# EasyEDA schematic schematics.json
TITLE: Axon - MIDI to CV; REV: 1.2; Date: 2024-01-22; Sheet: 1/1; Drawn By: Arthur LAURENT; Company: Mental Noise
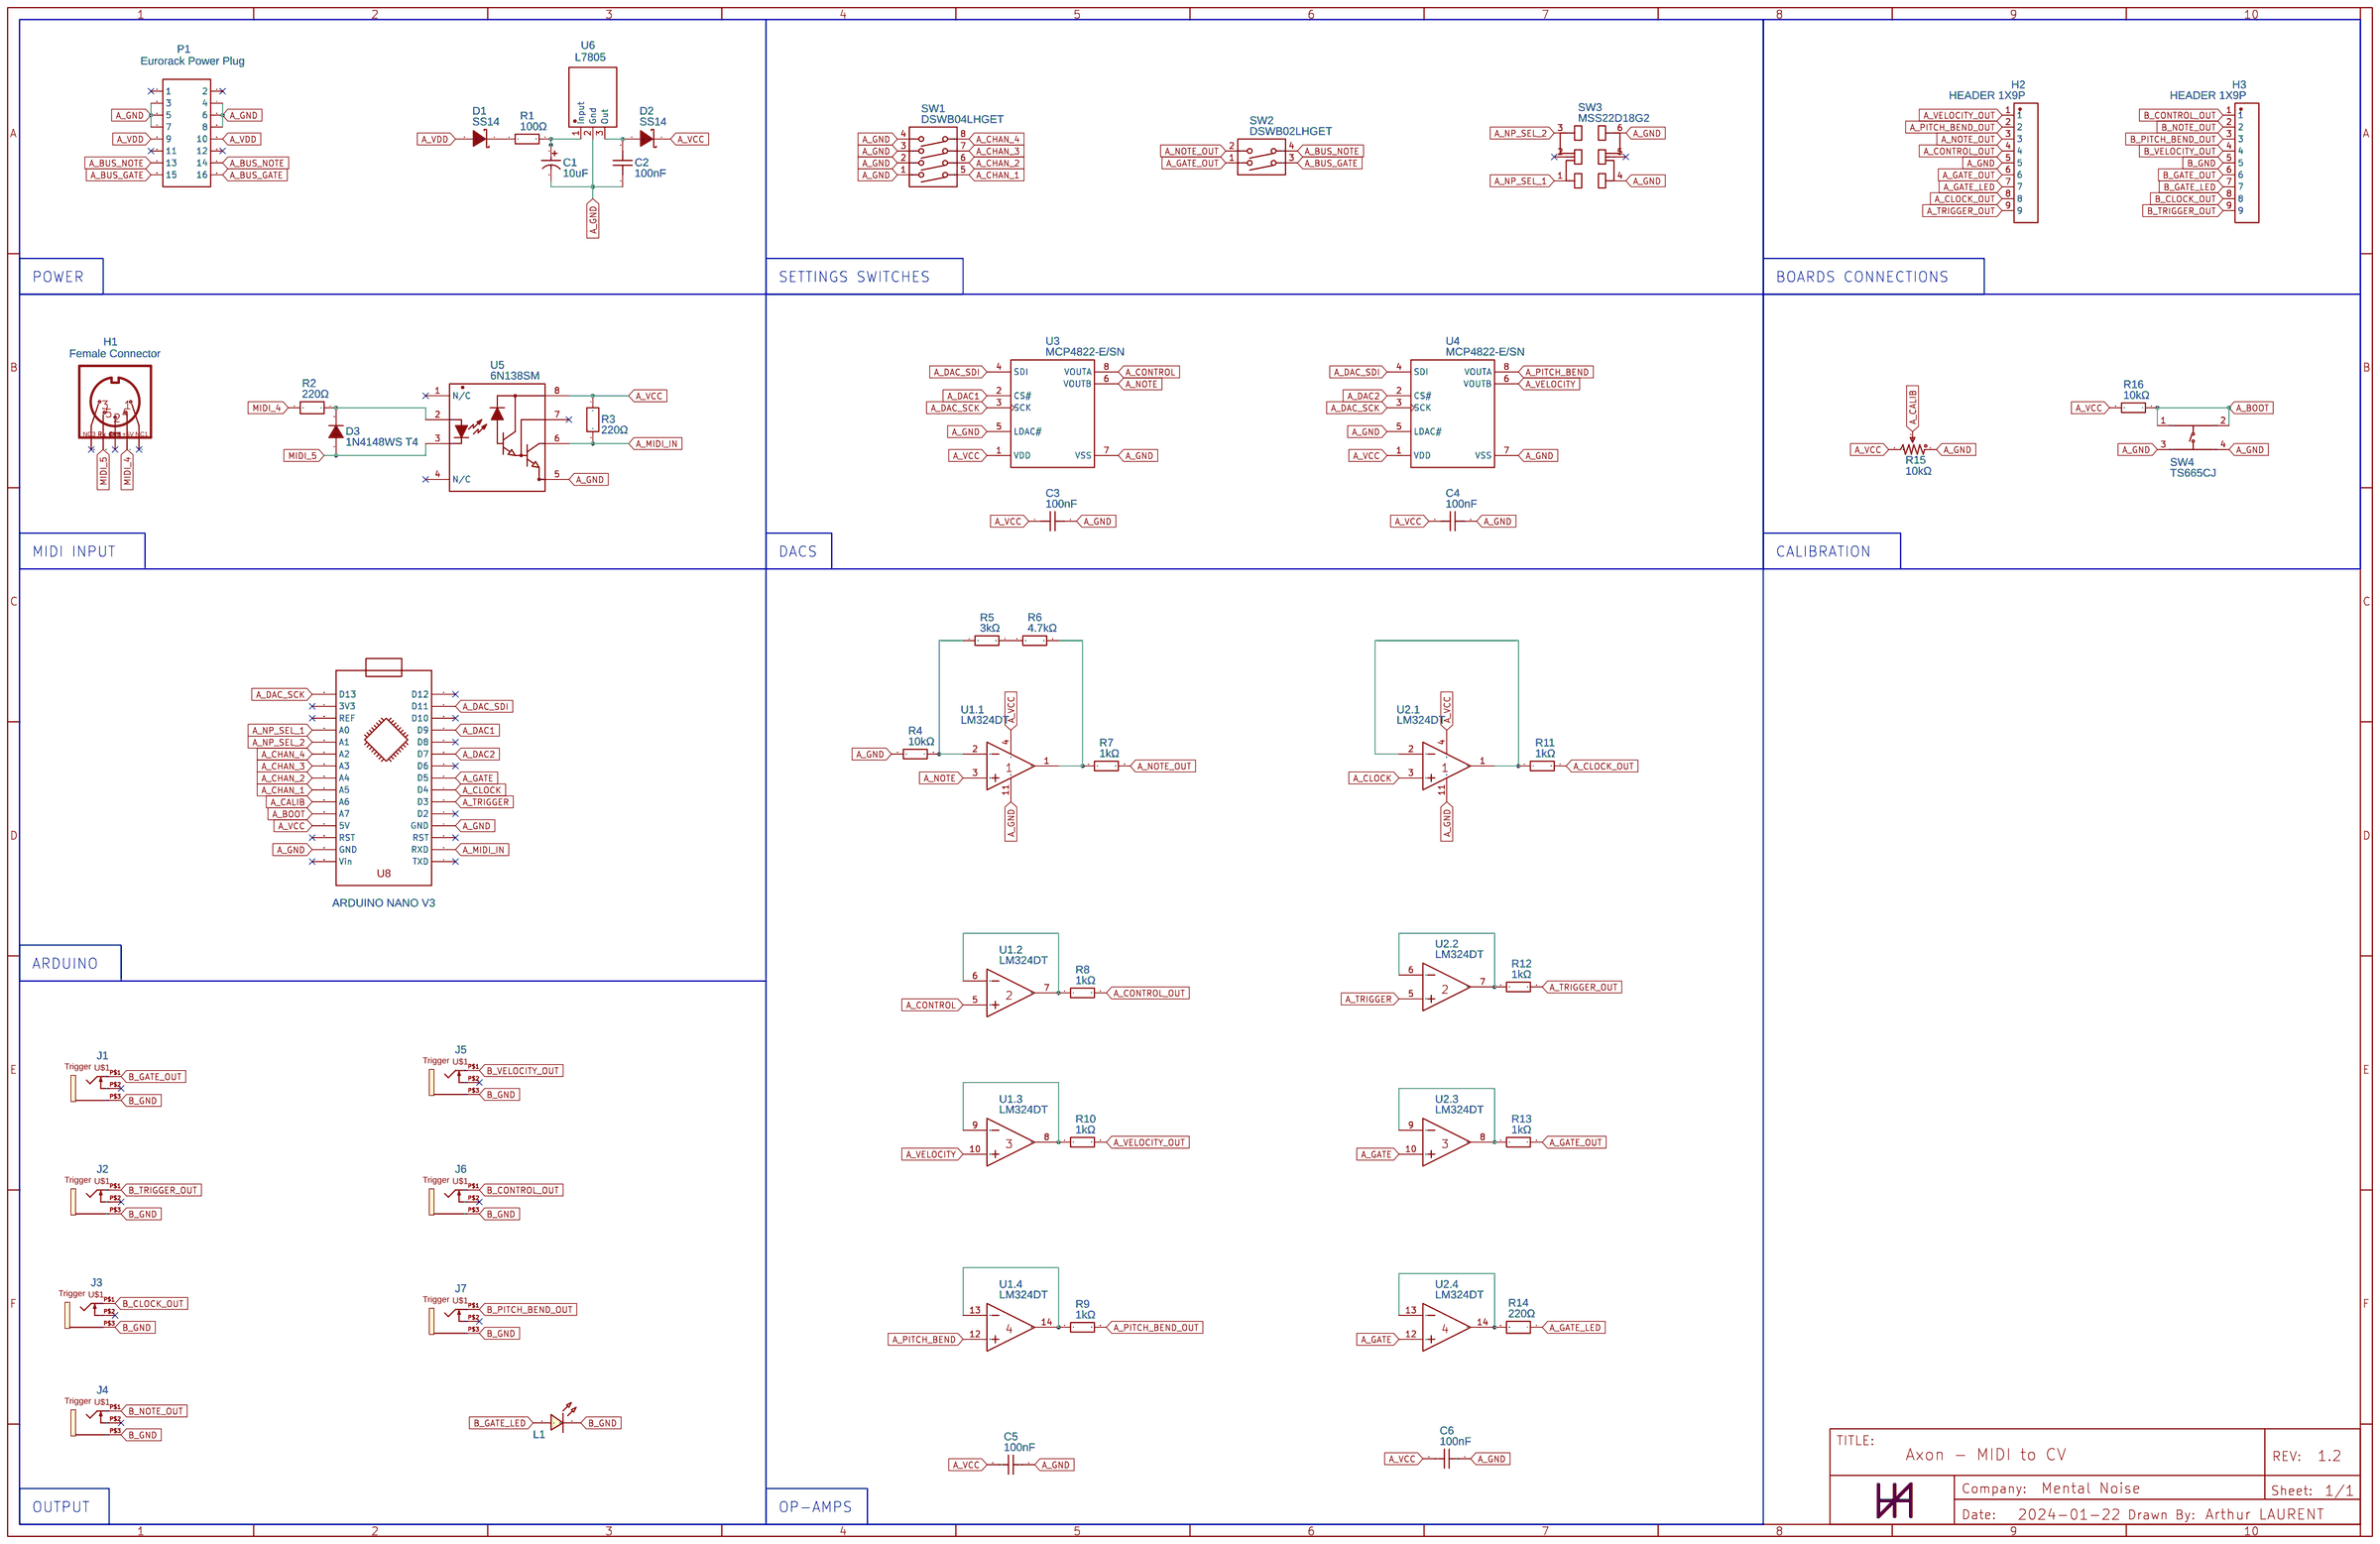
[diagram p0: schematic sheet]

## Parts
C1  10uF  [CAP-TH_BD5.0-P2.00-D0.8-FD]
C2  100nF  [C0603]
C3  100nF  [C0603]
C4  100nF  [C0603]
C5  100nF  [C0603]
C6  100nF  [C0603]
D1  SS14  [SMA_L4.2-W2.6-LS5.3-RD]
D2  SS14  [SMA_L4.2-W2.6-LS5.3-RD]
D3  1N4148WS T4  [SOD-323_L1.8-W1.3-LS2.5-RD]
H1  Female Connector  [GSG-HEADER-NOMARK-1X2]
H2  HEADER 1X9P  [HEADER 1X9P]
H3  HEADER 1X9P  [HEADER 1X9P]
J1  PJ301M  [PJ301M]
J2  PJ301M  [PJ301M]
J3  PJ301M  [PJ301M]
J4  PJ301M  [PJ301M]
J5  PJ301M  [PJ301M]
J6  PJ301M  [PJ301M]
J7  PJ301M  [PJ301M]
L1  LED-0603_R  [3MM LED LABELED]
P1  Eurorack Power Plug  [IDC-TH_16P-P2.54_C3406]
R1  100Ω  [R1206]
R2  220Ω  [R_RADIAL_P_2.54]
R3  220Ω  [R_RADIAL_P_2.54]
R4  10kΩ  [R0402]
R5  3kΩ  [R0603]
R6  4.7kΩ  [R0603]
R7  1kΩ  [R0402]
R8  1kΩ  [R0402]
R9  1kΩ  [R0402]
R10  1kΩ  [R0402]
R11  1kΩ  [R0402]
R12  1kΩ  [R0402]
R13  1kΩ  [R0402]
R14  220Ω  [R_RADIAL_P_2.54]
R15  10kΩ  [RES-ADJ-TH_3P-L10.0-W10.0-P2.50-L]
R16  10kΩ  [R0402]
SW1  DSWB04LHGET  [SW-TH_DSWB04LHGET]
SW2  DSWB02LHGET  [SW-TH_DSWB02LHGET]
SW3  MSS22D18G2  [SW-TH_MSS22D18GX]
SW4  TS665CJ  [SW-TH_4P-L6.0-W6.0-P4.50-LS6.5]
U1  LM324DT  [SOIC-14_L8.7-W3.9-P1.27-LS6.0-BL]  (sections 1,2,3,4)
U2  LM324DT  [SOIC-14_L8.7-W3.9-P1.27-LS6.0-BL]  (sections 1,2,3,4)
U3  MCP4822-E/SN  [SOIC-8_L4.9-W3.9-P1.27-LS6.0-BL]
U4  MCP4822-E/SN  [SOIC-8_L4.9-W3.9-P1.27-LS6.0-BL]
U5  6N138SM  [SMD-8_L9.7-W6.5-P2.54-LS10.3-BL]
U6  L7805  [TO-220-3_L10.0-W4.5-P2.54-L]
U7  ARDUINO NANO V3  [ARDUINO_NANO_SHORT]

## Library data of the parts
C1 = 47uF 25V 5*11: Supplier: LCSC; Manufacturer: ValuePro; Supplier Part: C43350
C2-C6 = CC0603KRX7R9BB104: Supplier: LCSC; Manufacturer: YAGEO(国巨); Supplier Part: C14663; JLCPCB Part Class: Basic Part
D1 D2 = SS14: Supplier: LCSC; Manufacturer: MDD; Supplier Part: C2480; JLCPCB Part Class: Basic Part
D3 = 1N4148WS T4: Supplier: LCSC; Manufacturer: CJ(江苏长电/长晶); Manufacturer Part: 1N4148WS; Supplier Part: C2128; JLCPCB Part Class: Basic Part
H1 = MIDI Connector: Contributor: Janosch_89
H2 H3 = HEADER 1X9P: Contributor: kirovcruise
J1-J7 = PJ301M: Manufacturer: thonk; link: https://www.thonk.co.uk/shop/thonkiconn/; Contributor: Christian Bloch
L1 = LED-0603_R: Manufacturer: EVERLIGHT(台湾亿光); Manufacturer Part: 19-217/R6C-AL1M2VY/3T; Supplier Part: C72044; Supplier: LCSC; Contributor: LCEDA_01
P1 = HDR-IDC-2.54-2X8P: Supplier: LCSC; Manufacturer: BOOMELE; Manufacturer Part: IDC Box 2.54mm 16P　Straight; image: //image.lceda.cn/szlcsc/C3406.jpg; Supplier Part: C3406
R1 = 1206W4F1000T5E: Supplier: LCSC; Manufacturer: UNI-ROYAL(厚声); Supplier Part: C17901; JLCPCB Part Class: Basic Part
R2 R3 R14 = R_0201_EU: Contributor: LCEDA_Lib
R4 R16 = 0402WGF1002TCE: Supplier: LCSC; Manufacturer: UNI-ROYAL(厚声); Supplier Part: C25744; JLCPCB Part Class: Basic Part
R5 = 0603WAF3001T5E: Supplier: LCSC; Manufacturer: UNI-ROYAL(厚声); Supplier Part: C4211; JLCPCB Part Class: Basic Part
R6 = 0603WAF4701T5E: Supplier: LCSC; Manufacturer: UNI-ROYAL(厚声); Supplier Part: C23162; JLCPCB Part Class: Basic Part
R7-R13 = 0402WGF1001TCE: Supplier: LCSC; Manufacturer: UNI-ROYAL(厚声); Supplier Part: C11702; JLCPCB Part Class: Basic Part
R15 = 3296W-1-103: Resistance(Ohms): 10K; Contributor: LCSC; Supplier: LCSC; Supplier Part: C118954; Manufacturer: BOCHEN(博晨); JLCPCB Part Class: Extended Part
SW1 = DSWB04LHGET: Contributor: LCSC; Supplier: LCSC; Supplier Part: C99418; Manufacturer: YE; JLCPCB Part Class: Extended Part
SW2 = DSWB02LHGET: Contributor: LCSC; Supplier: LCSC; Supplier Part: C99421; Manufacturer: YE; JLCPCB Part Class: Extended Part
SW3 = MSS22D18G2: Contributor: LCSC; Supplier: LCSC; Supplier Part: C431542; Manufacturer: SHOU HAN(首韩); JLCPCB Part Class: Extended Part
SW4 = TS665CJ: Contributor: LCSC; Supplier: LCSC; Supplier Part: C393938; Manufacturer: SHOU HAN(首韩); JLCPCB Part Class: Extended Part
U1 U2 = LM324DT: image: //image.lceda.cn/szlcsc/C71035.jpg; SMT Type: Basic; subpart_no: 2; Supplier: LCSC; Manufacturer: ST(意法半导体); Supplier Part: C71035; JLCPCB SMD: Yes; JLCPCB Part Class: Basic Part
U3 U4 = MCP4822-E/SN: Supplier: LCSC; Manufacturer: MICROCHIP(美国微芯); Supplier Part: C16040; JLCPCB Part Class: Extended Part
U5 = 6N138SM: Contributor: LCSC; Supplier: LCSC; Supplier Part: C255744; Manufacturer: ISOCOM(英国安数光); JLCPCB Part Class: Extended Part
U6 = L7805CV_C347289: Supplier: LCSC; Supplier Part: C347289; Manufacturer: Youtai Semiconductor Co., Ltd.; Manufacturer Part: L7805CV; Contributor: LCSC
U7 = ARDUINO NANO V3: Manufacturer Part: Arduino Nano; Contributor: Labamich netvoll; Package Display: No; Manufacturer: Arduino

## Nets
A_BOOT: R16.1 SW4.1(A) SW4.2(B) U7.26(A7)
A_BUS_GATE: P1.15 P1.16 SW2.3
A_BUS_NOTE: P1.13 P1.14 SW2.4
A_CALIB: R15.2 U7.25(A6)
A_CHAN_1: SW1.5 U7.24(A5)
A_CHAN_2: SW1.6 U7.23(A4)
A_CHAN_3: SW1.7 U7.22(A3)
A_CHAN_4: SW1.8 U7.21(A2)
A_CLOCK: U2.3(IN1+) U7.7(D4)
A_CLOCK_OUT: H2.8 R11.2
A_CONTROL: U1.5(IN2+) U3.8(VOUTA)
A_CONTROL_OUT: H2.4 R8.2
A_DAC1: U3.2(CS#) U7.12(D9)
A_DAC2: U4.2(CS#) U7.10(D7)
A_DAC_SCK: U3.3(SCK) U4.3(SCK) U7.16(D13)
A_DAC_SDI: U3.4(SDI) U4.4(SDI) U7.14(D11)
A_GATE: U2.10(IN3+) U2.12(IN4+) U7.8(D5)
A_GATE_LED: H2.7 R14.1
A_GATE_OUT: H2.6 R13.2 SW2.1
A_GND: C1.2 C2.1 C3.2 C4.2 C5.1 C6.1 H2.5 P1.3 P1.4 P1.5 P1.6 P1.7 P1.8 R4.1 R15.1 SW1.1 SW1.2 SW1.3 SW1.4 SW3.4 SW3.6 SW4.3(C) SW4.4(D) U1.11(VCC-) U2.11(VCC-) U3.5(LDAC#) U3.7(VSS) U4.5(LDAC#) U4.7(VSS) U5.5(GND) U6.2(Gnd) U7.4(GND) U7.29(GND)
A_MIDI_IN: R3.2 U5.6(VOUT) U7.2(RXD)
A_NOTE: U1.3(IN1+) U3.6(VOUTB)
A_NOTE_OUT: H2.3 R7.2 SW2.2
A_NP_SEL_1: SW3.1 U7.19(A0)
A_NP_SEL_2: SW3.3 U7.20(A1)
A_PITCH_BEND: U1.12(IN4+) U4.8(VOUTA)
A_PITCH_BEND_OUT: H2.2 R9.2
A_TRIGGER: U2.5(IN2+) U7.6(D3)
A_TRIGGER_OUT: H2.9 R12.2
A_VCC: C3.1 C4.1 C5.2 C6.2 D2.1(K) R3.1 R15.3 R16.2 U1.4(VCC+) U2.4(VCC+) U3.1(VDD) U4.1(VDD) U5.8(VCC) U7.27(5V)
A_VDD: D1.2(A) P1.9 P1.10
A_VELOCITY: U1.10(IN3+) U4.6(VOUTB)
A_VELOCITY_OUT: H2.1 R10.2
B_CLOCK_OUT: H3.8 J3.P$1(2)
B_CONTROL_OUT: H3.1 J6.P$1(2)
B_GATE_LED: H3.7 L1.2(1)
B_GATE_OUT: H3.6 J1.P$1(2)
B_GND: H3.5 J1.P$3(1) J2.P$3(1) J3.P$3(1) J4.P$3(1) J5.P$3(1) J6.P$3(1) J7.P$3(1) L1.1(2)
B_NOTE_OUT: H3.2 J4.P$1(2)
B_PITCH_BEND_OUT: H3.3 J7.P$1(2)
B_TRIGGER_OUT: H3.9 J2.P$1(2)
B_VELOCITY_OUT: H3.4 J5.P$1(2)
MIDI_4: H1.2(4) R2.2
MIDI_5: D3.2(A) H1.1(5) U5.3(C)
Net-(C1-1): C1.1 R1.2 U6.1(Input)
Net-(C2-2): C2.2 D2.2(A) U6.3(Out)
Net-(D1-1): D1.1(K) R1.1
Net-(D3-1): D3.1(K) R2.1 U5.2(A)
Net-(R4-2): R4.2 R5.1 U1.2(IN1-)
Net-(R5-2): R5.2 R6.1
Net-(R6-2): R6.2 R7.1 U1.1(OUT1)
Net-(R8-1): R8.1 U1.6(IN2-) U1.7(OUT2)
Net-(R9-1): R9.1 U1.13(IN4-) U1.14(OUT4)
Net-(R10-1): R10.1 U1.8(OUT3) U1.9(IN3-)
Net-(R11-1): R11.1 U2.1(OUT1) U2.2(IN1-)
Net-(R12-1): R12.1 U2.6(IN2-) U2.7(OUT2)
Net-(R13-1): R13.1 U2.8(OUT3) U2.9(IN3-)
Net-(R14-2): R14.2 U2.13(IN4-) U2.14(OUT4)

Not connected (* = marked no-connect by the designer): H1 3*; J1 P$2(3)*; J2 P$2(3)*; J3 P$2(3)*; J4 P$2(3)*; J5 P$2(3)*; J6 P$2(3)*; J7 P$2(3)*; P1 1* 2* 11* 12*; SW3 2* 5*; U5 1(N/C)* 4(N/C)* 7(VB)*; U7 1(TXD)* 3(RST)* 5(D2)* 9(D6)* 11(D8)* 13(D10)* 15(D12)* 17(3V3)* 18(REF)* 28(RST)* 30(Vin)*

## Notes on the sheet
- POWER
- SETTINGS SWITCHES
- BOARDS CONNECTIONS
- MIDI INPUT
- DACS
- CALIBRATION
- ARDUINO
- OUTPUT
- OP-AMPS
